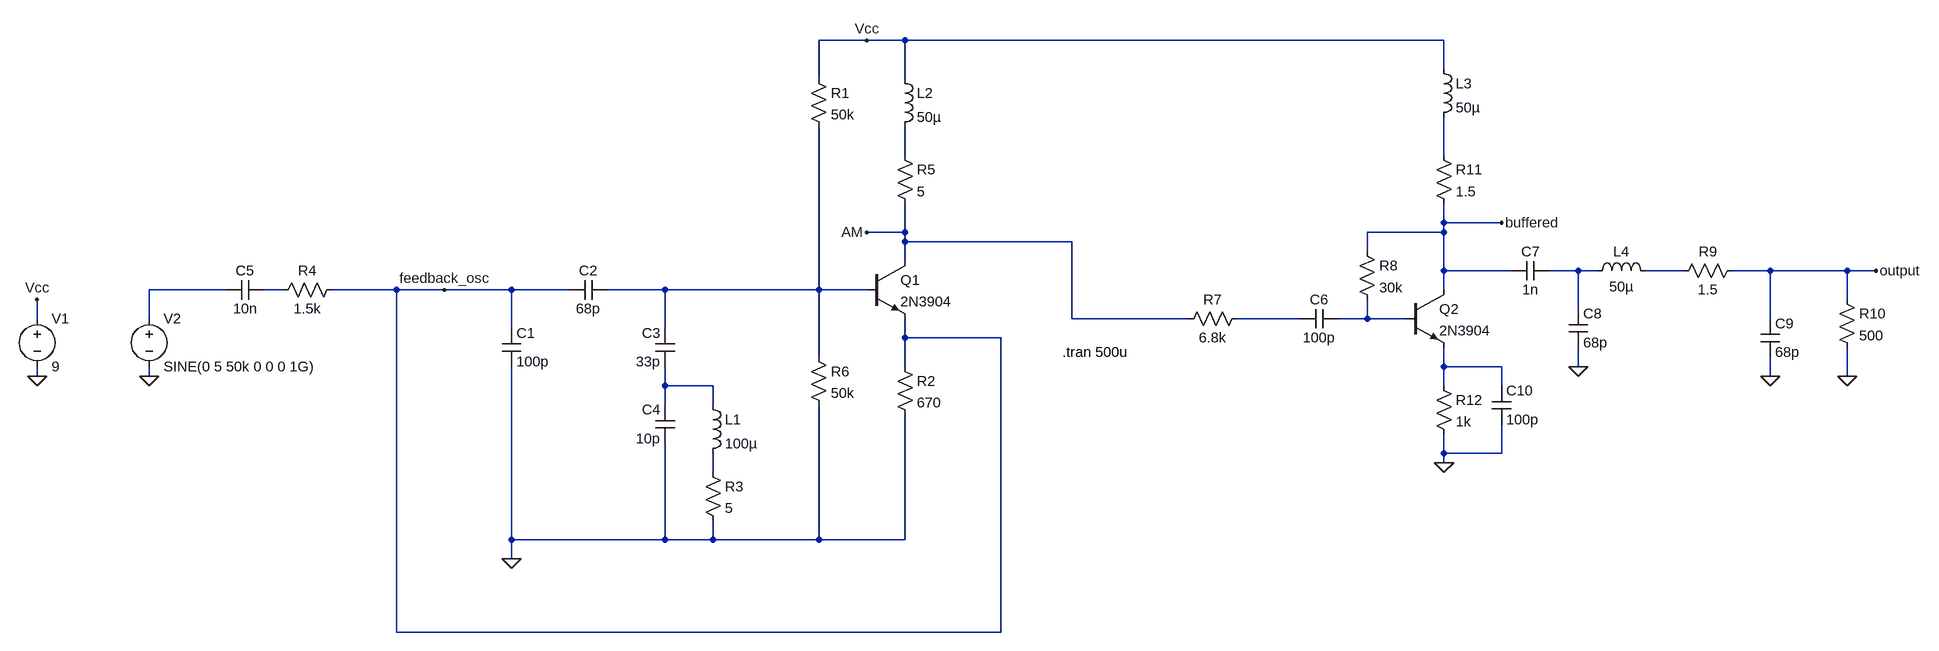
[diagram p0: schematic high_freq_oscillator.asc]
high_freq_oscillator.asc, the LTspice schematic file:
Version 4
SHEET 1 2464 740
WIRE 544 -352 464 -352
WIRE 608 -352 544 -352
WIRE 1648 -352 608 -352
WIRE 1648 -304 1648 -352
WIRE 464 -288 464 -352
WIRE 608 -288 608 -352
WIRE 608 -160 608 -208
WIRE 1648 -160 1648 -224
WIRE 1648 -48 1648 -80
WIRE 1744 -48 1648 -48
WIRE 608 -32 608 -80
WIRE 608 -32 544 -32
WIRE 1648 -32 1648 -48
WIRE 1648 -32 1520 -32
WIRE 608 -16 608 -32
WIRE 928 -16 608 -16
WIRE 1520 0 1520 -32
WIRE 608 16 608 -16
WIRE 1648 32 1648 -32
WIRE 1760 32 1648 32
WIRE 1872 32 1824 32
WIRE 1904 32 1872 32
WIRE 2048 32 1984 32
WIRE 2192 32 2128 32
WIRE 2320 32 2192 32
WIRE 2368 32 2320 32
WIRE -896 64 -1024 64
WIRE -800 64 -832 64
WIRE -240 64 -720 64
WIRE -160 64 -240 64
WIRE -48 64 -160 64
WIRE 48 64 -48 64
WIRE 208 64 112 64
WIRE 464 64 464 -208
WIRE 464 64 208 64
WIRE 544 64 464 64
WIRE 1648 64 1648 32
WIRE 2320 80 2320 32
WIRE 1872 96 1872 32
WIRE -1264 112 -1264 80
WIRE -1024 112 -1024 64
WIRE 928 112 928 -16
WIRE 1216 112 928 112
WIRE 1408 112 1296 112
WIRE 1520 112 1520 80
WIRE 1520 112 1472 112
WIRE 1584 112 1520 112
WIRE 2192 112 2192 32
WIRE -48 128 -48 64
WIRE 208 128 208 64
WIRE 608 144 608 112
WIRE 768 144 608 144
WIRE 464 176 464 64
WIRE 608 192 608 144
WIRE 1648 192 1648 160
WIRE 1744 192 1648 192
WIRE 1872 192 1872 160
WIRE -1264 208 -1264 192
WIRE -1024 208 -1024 192
WIRE 2192 208 2192 176
WIRE 2320 208 2320 160
WIRE 208 224 208 192
WIRE 288 224 208 224
WIRE 1648 224 1648 192
WIRE 1744 224 1744 192
WIRE 208 256 208 224
WIRE 288 256 288 224
WIRE 1648 336 1648 304
WIRE 1744 336 1744 288
WIRE 1744 336 1648 336
WIRE 1648 352 1648 336
WIRE 288 368 288 336
WIRE -48 480 -48 192
WIRE 208 480 208 320
WIRE 208 480 -48 480
WIRE 288 480 288 448
WIRE 288 480 208 480
WIRE 464 480 464 256
WIRE 464 480 288 480
WIRE 608 480 608 272
WIRE 608 480 464 480
WIRE -48 512 -48 480
WIRE -240 736 -240 64
WIRE 768 736 768 144
WIRE 768 736 -240 736
FLAG -48 512 0
FLAG 544 -352 Vcc
FLAG -1264 208 0
FLAG -1264 80 Vcc
FLAG -1024 208 0
FLAG 2368 32 output
FLAG -160 64 feedback_osc
FLAG 1648 352 0
FLAG 544 -32 AM
FLAG 1744 -48 buffered
FLAG 2320 208 0
FLAG 2192 208 0
FLAG 1872 192 0
SYMBOL cap -64 128 R0
SYMATTR InstName C1
SYMATTR Value 100p
SYMBOL cap 112 48 R90
WINDOW 0 0 32 VBottom 2
WINDOW 3 32 32 VTop 2
SYMATTR InstName C2
SYMATTR Value 68p
SYMBOL cap 224 192 R180
WINDOW 0 24 56 Left 2
WINDOW 3 24 8 Left 2
SYMATTR InstName C3
SYMATTR Value 33p
SYMBOL cap 224 320 R180
WINDOW 0 24 56 Left 2
WINDOW 3 24 8 Left 2
SYMATTR InstName C4
SYMATTR Value 10p
SYMBOL ind 272 240 R0
SYMATTR InstName L1
SYMATTR Value 100µ
SYMBOL npn 544 16 R0
SYMATTR InstName Q1
SYMATTR Value 2N3904
SYMBOL res 448 -304 R0
SYMATTR InstName R1
SYMATTR Value 50k
SYMBOL res 592 176 R0
SYMATTR InstName R2
SYMATTR Value 670
SYMBOL voltage -1264 96 R0
WINDOW 123 0 0 Left 0
WINDOW 39 0 0 Left 0
SYMATTR InstName V1
SYMATTR Value 9
SYMBOL res -704 48 R90
WINDOW 0 0 56 VBottom 2
WINDOW 3 32 56 VTop 2
SYMATTR InstName R4
SYMATTR Value 1.5k
SYMBOL cap -832 48 R90
WINDOW 0 0 32 VBottom 2
WINDOW 3 32 32 VTop 2
SYMATTR InstName C5
SYMATTR Value 10n
SYMBOL voltage -1024 96 R0
WINDOW 123 0 0 Left 0
WINDOW 39 0 0 Left 0
SYMATTR InstName V2
SYMATTR Value SINE(0 5 50k 0 0 0 1G)
SYMBOL ind 592 -304 R0
SYMATTR InstName L2
SYMATTR Value 50µ
SYMBOL res 272 352 R0
SYMATTR InstName R3
SYMATTR Value 5
SYMBOL res 448 160 R0
SYMATTR InstName R6
SYMATTR Value 50k
SYMBOL res 592 -176 R0
SYMATTR InstName R5
SYMATTR Value 5
SYMBOL cap 1472 96 R90
WINDOW 0 0 32 VBottom 2
WINDOW 3 32 32 VTop 2
SYMATTR InstName C6
SYMATTR Value 100p
SYMBOL npn 1584 64 R0
SYMATTR InstName Q2
SYMATTR Value 2N3904
SYMBOL ind 1632 -320 R0
SYMATTR InstName L3
SYMATTR Value 50µ
SYMBOL res 1504 -16 R0
SYMATTR InstName R8
SYMATTR Value 30k
SYMBOL cap 1824 16 R90
WINDOW 0 0 32 VBottom 2
WINDOW 3 32 32 VTop 2
SYMATTR InstName C7
SYMATTR Value 1n
SYMBOL cap 2176 112 R0
SYMATTR InstName C9
SYMATTR Value 68p
SYMBOL ind 1888 48 R270
WINDOW 0 32 56 VTop 2
WINDOW 3 5 56 VBottom 2
SYMATTR InstName L4
SYMATTR Value 50µ
SYMBOL res 2144 16 R90
WINDOW 0 0 56 VBottom 2
WINDOW 3 32 56 VTop 2
SYMATTR InstName R9
SYMATTR Value 1.5
SYMBOL res 1312 96 R90
WINDOW 0 0 56 VBottom 2
WINDOW 3 32 56 VTop 2
SYMATTR InstName R7
SYMATTR Value 6.8k
SYMBOL res 2304 64 R0
SYMATTR InstName R10
SYMATTR Value 500
SYMBOL res 1632 -176 R0
SYMATTR InstName R11
SYMATTR Value 1.5
SYMBOL cap 1856 96 R0
SYMATTR InstName C8
SYMATTR Value 68p
SYMBOL res 1632 208 R0
SYMATTR InstName R12
SYMATTR Value 1k
SYMBOL cap 1728 224 R0
SYMATTR InstName C10
SYMATTR Value 100p
TEXT 912 168 Left 2 !.tran 500u

The netlist it stands for:
* high_freq_oscillator.asc
C1 feedback_osc 0 100p
C2 N007 feedback_osc 68p
C3 N011 N007 33p
C4 0 N011 10p
L1 N011 N012 100µ
Q1 AM N007 feedback_osc 0 2N3904
R1 Vcc N007 50k
R2 feedback_osc 0 670
V1 Vcc 0 9
R4 feedback_osc N006 1.5k
C5 N006 N005 10n
V2 N005 0 SINE(0 5 50k 0 0 0 1G)
L2 Vcc N001 50µ
R3 N012 0 5
R6 N007 0 50k
R5 N001 AM 5
C6 N009 N008 100p
Q2 buffered N009 N010 0 2N3904
L3 Vcc N002 50µ
R8 buffered N009 30k
C7 N003 buffered 1n
C9 output 0 68p
L4 N003 N004 50µ
R9 output N004 1.5
R7 N008 AM 6.8k
R10 output 0 500
R11 N002 buffered 1.5
C8 N003 0 68p
R12 N010 0 1k
C10 N010 0 100p
.model NPN NPN
.model PNP PNP
.lib standard.bjt
.tran 500u
.backanno
.end